# Altium schematic sheet Optical_RX.SchDoc
size A4; Author: T. Kreppel; CompanyName: Technische Universität München; Organization: TUM EAL; Address1: Arcisstraße 21; Address2: 80333 München; Address3: GERMANY; SheetNumber: 5; SheetTotal: 6; CompanyName2: Lehrstuhl für Elektrische Antriebsrechnik u. Leistungselektronik
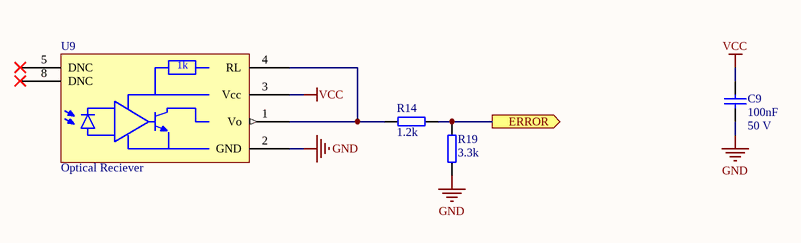
[diagram p0: Optical_RX.SchDoc]

## Parts
C9  Voltage: 50 V  [C_0603(1608)100_L]  (hidden comment: 100nF)
R14  1.2k  [R_0603_N]
R19  3.3k  [R_0603_N]
U9  Optical Reciever  [HFBRx5XX]

## Ports
ERROR (out)

## Nets
GND: C9.2 R19.1 U9.2(GND)
VCC: C9.1 U9.3(Vcc)
ERROR: R14.2 R19.2 ; port ERROR
NetR14_1: R14.1 U9.1(Vo) U9.4(RL)

Not connected (* = marked no-connect by the designer): U9 5(DNC)* 8(DNC)*

## Notes on the sheet
- Title
- Size:
- Date:
- A4
- Revision:
- Time:
- Sheet
- of
- Author:
- Project:
- (in symbol HFBR-2528Z) 1k

## Library data of the parts
C9 = C_0603: CAP 0603 (1608 Metric) SMD; MPN: CC0603MRY5V9BB104; Tolerance: ±20%; Case-Metric: 1608; Dielectric: X5V; MF: Yageo; Case-EIA: 0603; Max Thickness: 1 mm; Technology: SMT; Created: 2018_09_06_AGeiger; Supplier 1: Mouser; Supplier Part Number 1: 603-C0603MRY5V9BB104; Value: 100nF; Package: 0603
R14 = R_0603: SMD Resistor 0603; MPN: RC0603FR-071K2L; Tolerance: 1%; Voltage: 75 V; Power: 100 mW; MF: Yageo; Package: 0603; Value: 1.2k; Created: 2018_09_06_AGeiger; Supplier 1: Mouser; Supplier Part Number 1: 603-RC0603FR-071K2L
R19 = R_0603: SMD Resistor 0603; MPN: CRCW06033K30FKEAC; Tolerance: 1%; Voltage: 75 V; Power: 100 mW; MF: Vishay; Package: 0603; Value: 3.3k; Created: 2018_09_06_AGeiger; Supplier 1: Mouser; Supplier Part Number 1: 71-CRCW06033K30FKEAC
U9 = HFBR-2528Z: Fibre Optic Transmitters, Receivers, Transceivers V-LINK HORIZ 5MBd RC VR RoHS; MPN: HFBR-2521Z; Suppier Part Number 2: 516-2062-ND; MF: Boadcom/Avago; Wavelength: 660 nm; Iout max: 25 mA; Supply Voltage: 5V; Created: 2019_04_09_Kreppel; Data Rate: 5 MBd; Supplier 1: Mouser; Supplier 2: Digi-Key; Supplier Part Number 1: 630-HFBR-2521Z